# EAGLE design BPB_v16 (EAGLE 9.4.2)
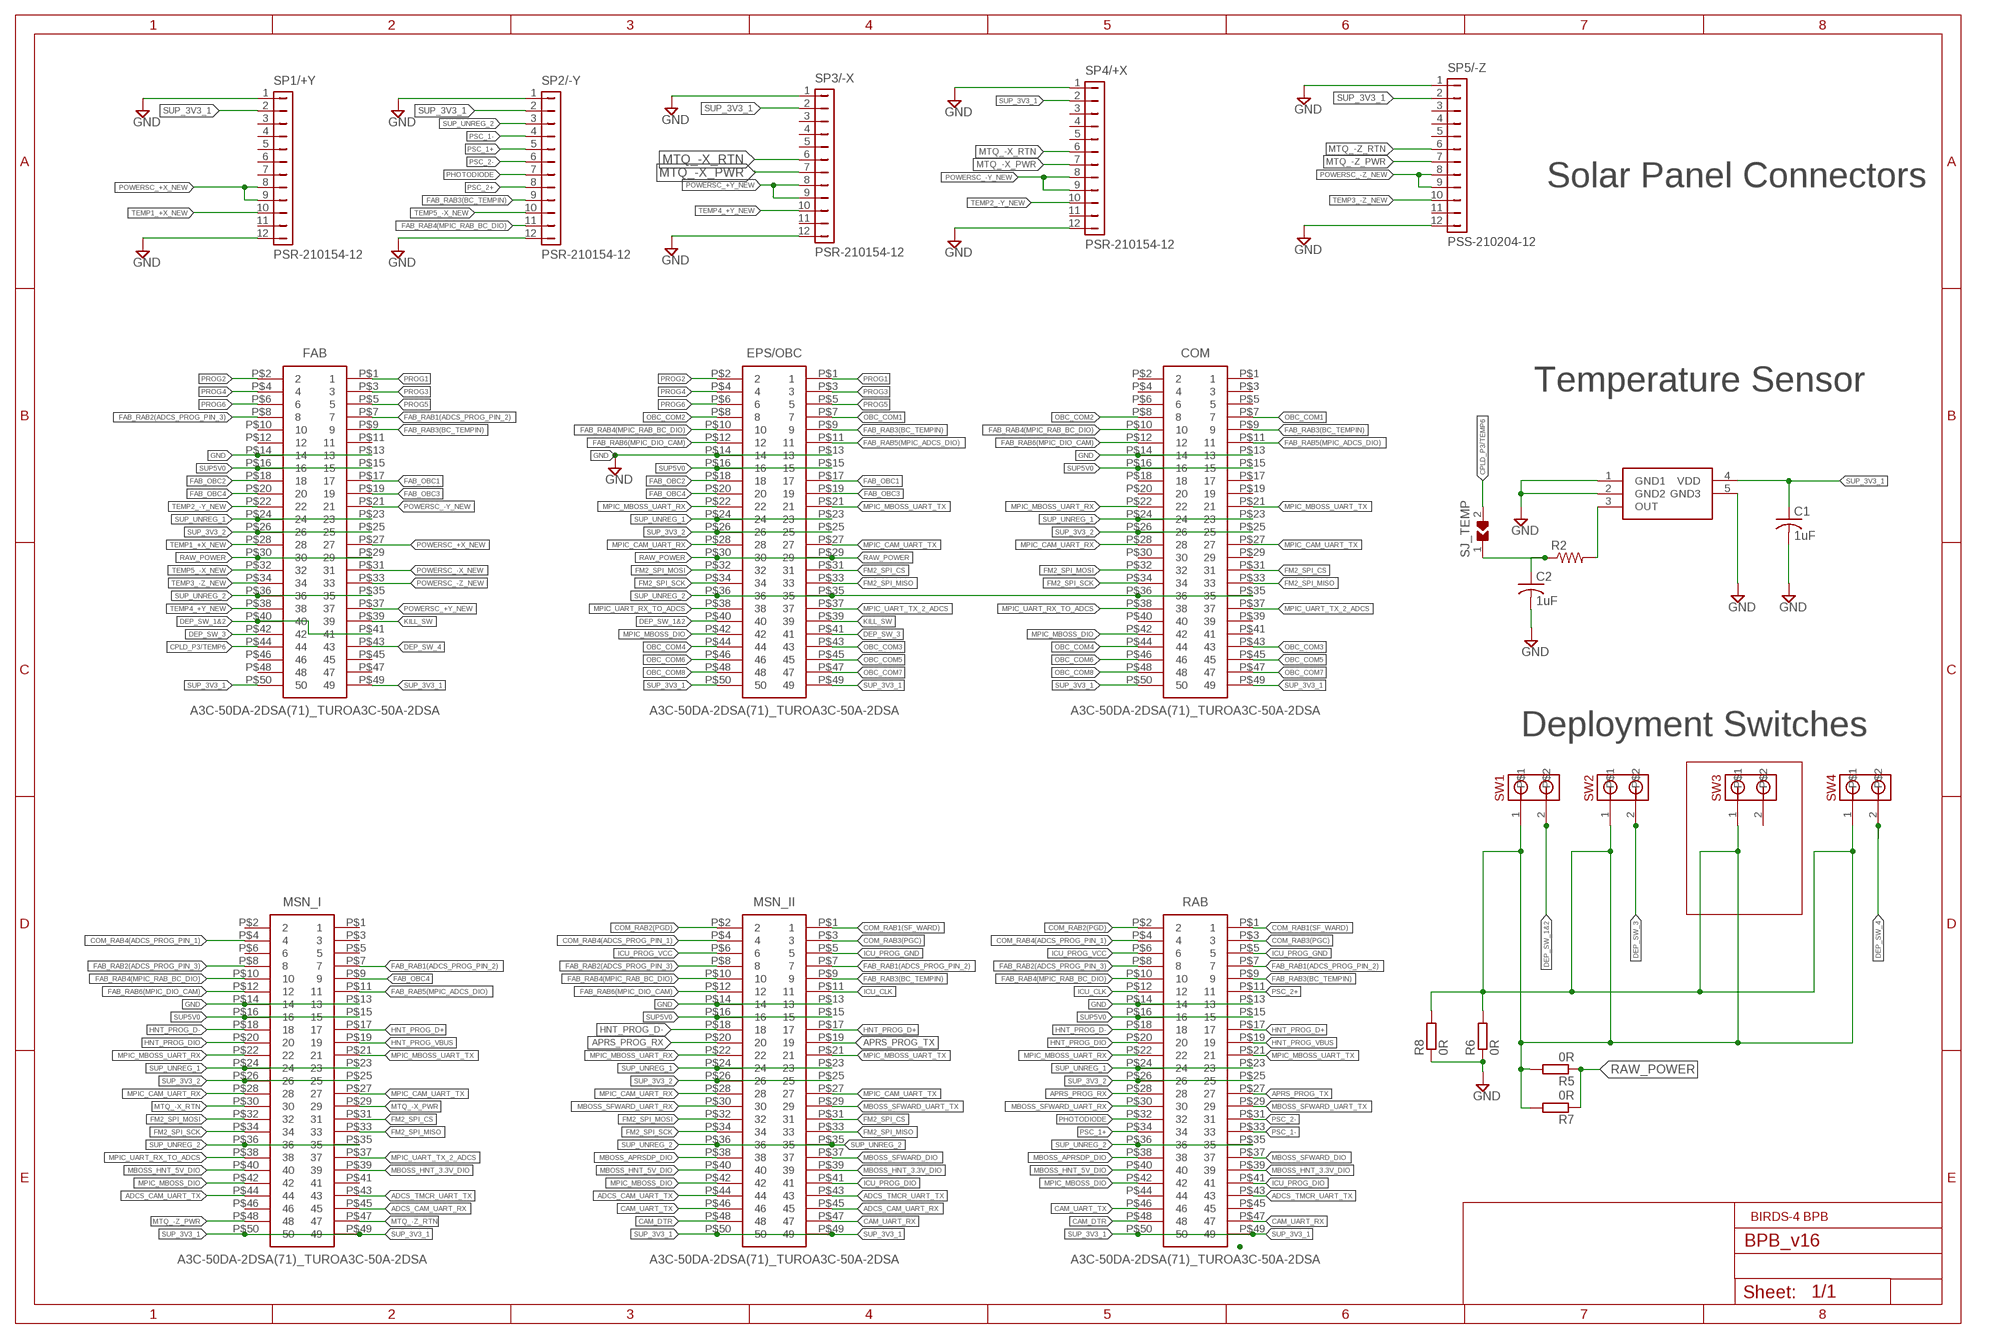
[diagram p0: schematic, sheet 1]

## Parts
C1  1uF  C-USC0603  [C0603]
C2  1uF  C-USC0603  [C0603]
COM  A3C-50DA-2DSA(71)_TUROA3C-50A-2DSA  [SHDR50W60P200_2X25_5000X400X44_TR]
EPS/OBC  A3C-50DA-2DSA(71)_TUROA3C-50A-2DSA  [SHDR50W60P200_2X25_5000X400X44_TR]
FAB  A3C-50DA-2DSA(71)_TUROA3C-50A-2DSA  [SHDR50W60P200_2X25_5000X400X44_TR]
MSN_I  A3C-50DA-2DSA(71)_TUROA3C-50A-2DSA  [SHDR50W60P200_2X25_5000X400X44_TR]
MSN_II  A3C-50DA-2DSA(71)_TUROA3C-50A-2DSA  [SHDR50W60P200_2X25_5000X400X44_TR]
R2  R-US_R0402  [R0402]
R5  0R  RR3216  [R3216]
R6  0R  RR3216  [R3216]
R7  0R  RR3216  [R3216]
R8  0R  RR3216  [R3216]
RAB  A3C-50DA-2DSA(71)_TUROA3C-50A-2DSA  [SHDR50W60P200_2X25_5000X400X44_TR]
SJ_TEMP  SJ_BY_TURO  [SJ_TURO]
SP1/+Y  PSR-210154-12  [PIN1X12/90]
SP2/-Y  PSR-210154-12  [PIN1X12/90]
SP3/-X  PSR-210154-12  [PIN1X12/90]
SP4/+X  PSR-210154-12  [PIN1X12/90]
SP5/-Z  PSS-210204-12  [PIN1X12]
SW1  MOLEX-CONN-2-0554600272  [MOLEX-CONN-2-BIRDS]
SW2  MOLEX-CONN-2-0554600272  [MOLEX-CONN-2-BIRDS]
SW3  MOLEX-CONN-2-0554600272  [MOLEX-CONN-2-BIRDS]
SW4  MOLEX-CONN-2-0554600272  [MOLEX-CONN-2-BIRDS]
U$3  LMT84DCKT  [SOT65P210X110-5N]

## Nets
ADCS_CAM_UART_RX: MSN_I.P$45 MSN_II.P$45
ADCS_CAM_UART_TX: MSN_I.P$44 MSN_II.P$44
ADCS_TMCR_UART_TX: MSN_I.P$43 MSN_II.P$43 RAB.P$43
APRS_PROG_RX: MSN_II.P$20 RAB.P$28
APRS_PROG_TX: MSN_II.P$19 RAB.P$27
CAM_DTR: MSN_II.P$48 RAB.P$48
CAM_UART_RX: MSN_II.P$47 RAB.P$47
CAM_UART_TX: MSN_II.P$46 RAB.P$46
COM_RAB1(SF_WARD): MSN_II.P$1 RAB.P$1
COM_RAB2(PGD): MSN_II.P$2 RAB.P$2
COM_RAB3(PGC): MSN_II.P$3 RAB.P$3
COM_RAB4(ADCS_PROG_PIN_1): MSN_I.P$4 MSN_II.P$4 RAB.P$4
CPLD_P3/TEMP6: FAB.P$44 SJ_TEMP.2
DEP_SW_1&2: EPS/OBC.P$40 FAB.P$40 FAB.P$41 SW1.2
DEP_SW_3: EPS/OBC.P$41 FAB.P$42 SW2.2
DEP_SW_4: FAB.P$43 SW4.2
DEP_SW_POWER: R5.2 R6.2 R7.2 R8.2 SW1.1 SW2.1 SW3.1 SW4.1
FAB_OBC1: EPS/OBC.P$17 FAB.P$17
FAB_OBC2: EPS/OBC.P$18 FAB.P$18
FAB_OBC3: EPS/OBC.P$19 FAB.P$19
FAB_OBC4: EPS/OBC.P$20 FAB.P$20 MSN_I.P$9
FAB_RAB1(ADCS_PROG_PIN_2): FAB.P$7 MSN_I.P$7 MSN_II.P$7 RAB.P$7
FAB_RAB2(ADCS_PROG_PIN_3): FAB.P$8 MSN_I.P$8 MSN_II.P$8 RAB.P$8
FAB_RAB3(BC_TEMPIN): COM.P$9 EPS/OBC.P$9 FAB.P$9 MSN_II.P$9 RAB.P$9 SP2/-Y.9
FAB_RAB4(MPIC_RAB_BC_DIO): COM.P$10 EPS/OBC.P$10 MSN_I.P$10 MSN_II.P$10 RAB.P$10 SP2/-Y.11
FAB_RAB5(MPIC_ADCS_DIO): COM.P$11 EPS/OBC.P$11 MSN_I.P$11
FAB_RAB6(MPIC_DIO_CAM): COM.P$12 EPS/OBC.P$12 MSN_I.P$12 MSN_II.P$12
FM2_SPI_CS: COM.P$31 EPS/OBC.P$31 MSN_I.P$31 MSN_II.P$31
FM2_SPI_MISO: COM.P$33 EPS/OBC.P$33 MSN_I.P$33 MSN_II.P$33
FM2_SPI_MOSI: COM.P$32 EPS/OBC.P$32 MSN_I.P$32 MSN_II.P$32
FM2_SPI_SCK: COM.P$34 EPS/OBC.P$34 MSN_I.P$34 MSN_II.P$34
GND [GND]: C1.2 C2.2 COM.P$13 COM.P$14 EPS/OBC.P$13 EPS/OBC.P$14 FAB.P$13 FAB.P$14 MSN_I.P$13 MSN_I.P$14 MSN_II.P$13 MSN_II.P$14 R6.1 R8.1 RAB.P$13 RAB.P$14 SP1/+Y.1 SP1/+Y.12 SP2/-Y.1 SP2/-Y.12 SP3/-X.1 SP3/-X.12 SP4/+X.1 SP4/+X.12 SP5/-Z.1 SP5/-Z.12 U$3.1(GND1) U$3.2(GND2) U$3.5(GND3)
HNT_PROG_D+: MSN_I.P$17 MSN_II.P$17 RAB.P$17
HNT_PROG_D-: MSN_I.P$18 MSN_II.P$18 RAB.P$18
HNT_PROG_DIO: MSN_I.P$20 RAB.P$20
HNT_PROG_VBUS: MSN_I.P$19 RAB.P$19
ICU_CLK: MSN_II.P$11 RAB.P$12
ICU_PROG_DIO: MSN_II.P$41 RAB.P$41
ICU_PROG_GND: MSN_II.P$5 RAB.P$5
ICU_PROG_VCC: MSN_II.P$6 RAB.P$6
KILL_SW: EPS/OBC.P$39 FAB.P$39
MBOSS_APRSDP_DIO: MSN_II.P$38 RAB.P$38
MBOSS_HNT_3.3V_DIO: MSN_I.P$39 MSN_II.P$39 RAB.P$39
MBOSS_HNT_5V_DIO: MSN_I.P$40 MSN_II.P$40 RAB.P$40
MBOSS_SFWARD_DIO: MSN_II.P$37 RAB.P$37
MBOSS_SFWARD_UART_RX: MSN_II.P$30 RAB.P$30
MBOSS_SFWARD_UART_TX: MSN_II.P$29 RAB.P$29
MPIC_CAM_UART_RX: COM.P$28 EPS/OBC.P$28 MSN_I.P$28 MSN_II.P$28
MPIC_CAM_UART_TX: COM.P$27 EPS/OBC.P$27 MSN_I.P$27 MSN_II.P$27
MPIC_MBOSS_DIO: COM.P$42 EPS/OBC.P$42 MSN_I.P$42 MSN_II.P$42 RAB.P$42
MPIC_MBOSS_UART_RX: COM.P$22 EPS/OBC.P$22 MSN_I.P$22 MSN_II.P$22 RAB.P$22
MPIC_MBOSS_UART_TX: COM.P$21 EPS/OBC.P$21 MSN_I.P$21 MSN_II.P$21 RAB.P$21
MPIC_UART_RX_TO_ADCS: COM.P$38 EPS/OBC.P$38 MSN_I.P$38
MPIC_UART_TX_2_ADCS: COM.P$37 EPS/OBC.P$37 MSN_I.P$37
MTQ_-X_PWR: MSN_I.P$29 SP3/-X.7 SP4/+X.7
MTQ_-X_RTN: MSN_I.P$30 SP3/-X.6 SP4/+X.6
MTQ_-Z_PWR: MSN_I.P$48 SP5/-Z.7
MTQ_-Z_RTN: MSN_I.P$47 SP5/-Z.6
N$2: C2.1 R2.1 SJ_TEMP.1
N$4: R2.2 U$3.3(OUT)
OBC_COM1: COM.P$7 EPS/OBC.P$7
OBC_COM2: COM.P$8 EPS/OBC.P$8
OBC_COM3: COM.P$43 EPS/OBC.P$43
OBC_COM4: COM.P$44 EPS/OBC.P$44
OBC_COM5: COM.P$45 EPS/OBC.P$45
OBC_COM6: COM.P$46 EPS/OBC.P$46
OBC_COM7: COM.P$47 EPS/OBC.P$47
OBC_COM8: COM.P$48 EPS/OBC.P$48
PHOTODIODE: RAB.P$32 SP2/-Y.7
POWERSC_+X_NEW [POWER]: FAB.P$27 SP1/+Y.8 SP1/+Y.9
POWERSC_+Y_NEW [POWER]: FAB.P$37 SP3/-X.8 SP3/-X.9
POWERSC_-X_NEW [POWER]: FAB.P$31
POWERSC_-Y_NEW [POWER]: FAB.P$21 SP4/+X.8 SP4/+X.9
POWERSC_-Z_NEW [POWER]: FAB.P$33 SP5/-Z.8 SP5/-Z.9
PROG1: EPS/OBC.P$1 FAB.P$1
PROG2: EPS/OBC.P$2 FAB.P$2
PROG3: EPS/OBC.P$3 FAB.P$3
PROG4: EPS/OBC.P$4 FAB.P$4
PROG5: EPS/OBC.P$5 FAB.P$5
PROG6: EPS/OBC.P$6 FAB.P$6
PSC_1+: RAB.P$34 SP2/-Y.5
PSC_1-: RAB.P$33 SP2/-Y.4
PSC_2+: RAB.P$11 SP2/-Y.8
PSC_2-: RAB.P$31 SP2/-Y.6
RAW_POWER: EPS/OBC.P$29 EPS/OBC.P$30 FAB.P$29 FAB.P$30 R5.1 R7.1
SUP5V0 [POWER]: COM.P$15 COM.P$16 EPS/OBC.P$15 EPS/OBC.P$16 FAB.P$15 FAB.P$16 MSN_I.P$15 MSN_I.P$16 MSN_II.P$15 MSN_II.P$16 RAB.P$15 RAB.P$16
SUP_3V3_1 [POWER]: C1.1 COM.P$49 COM.P$50 EPS/OBC.P$49 EPS/OBC.P$50 FAB.P$49 FAB.P$50 MSN_I.P$49 MSN_I.P$50 MSN_II.P$49 MSN_II.P$50 RAB.P$49 RAB.P$50 SP1/+Y.2 SP2/-Y.2 SP3/-X.2 SP4/+X.2 SP5/-Z.2 U$3.4(VDD)
SUP_3V3_2 [POWER]: COM.P$25 COM.P$26 EPS/OBC.P$25 EPS/OBC.P$26 FAB.P$25 FAB.P$26 MSN_I.P$25 MSN_I.P$26 MSN_II.P$25 MSN_II.P$26 RAB.P$25 RAB.P$26
SUP_UNREG_1 [POWER]: COM.P$23 COM.P$24 EPS/OBC.P$23 EPS/OBC.P$24 FAB.P$23 FAB.P$24 MSN_I.P$23 MSN_I.P$24 MSN_II.P$23 MSN_II.P$24 RAB.P$23 RAB.P$24
SUP_UNREG_2 [POWER]: COM.P$35 COM.P$36 EPS/OBC.P$35 EPS/OBC.P$36 FAB.P$35 FAB.P$36 MSN_I.P$35 MSN_I.P$36 MSN_II.P$35 MSN_II.P$36 RAB.P$35 RAB.P$36 SP2/-Y.3
TEMP1_+X_NEW: FAB.P$28 SP1/+Y.10
TEMP2_-Y_NEW: FAB.P$22 SP4/+X.10
TEMP3_-Z_NEW: FAB.P$34 SP5/-Z.10
TEMP4_+Y_NEW: FAB.P$38 SP3/-X.10
TEMP5_-X_NEW: FAB.P$32 SP2/-Y.10
Unconnected: COM.P$1 COM.P$2 COM.P$3 COM.P$4 COM.P$5 COM.P$6 COM.P$17 COM.P$18 COM.P$19 COM.P$20 COM.P$29 COM.P$30 COM.P$39 COM.P$40 COM.P$41 FAB.P$10 FAB.P$11 FAB.P$12 FAB.P$45 FAB.P$46 FAB.P$47 FAB.P$48 MSN_I.P$1 MSN_I.P$2 MSN_I.P$3 MSN_I.P$5 MSN_I.P$6 MSN_I.P$41 MSN_I.P$46 RAB.P$44 RAB.P$45 SP1/+Y.3 SP1/+Y.4 SP1/+Y.5 SP1/+Y.6 SP1/+Y.7 SP1/+Y.11 SP3/-X.3 SP3/-X.4 SP3/-X.5 SP3/-X.11 SP4/+X.3 SP4/+X.4 SP4/+X.5 SP4/+X.11 SP5/-Z.3 SP5/-Z.4 SP5/-Z.5 SP5/-Z.11 SW3.2

## Notes on the sheet
- Solar Panel Connectors
- Temperature Sensor
- Deployment Switches
- BIRDS-4 BPB

## Library data of the parts
C1 C2 = rcl:C-US: CAPACITOR, American symbol; SPICEPREFIX: C
COM EPS/OBC FAB MSN_I MSN_II RAB = Turo_collection:A3C-50DA-2DSA(71)_TURO: Hirose A3C Series 2mm 50 Way 2 Row Straight PCB Socket Through Hole Board to Wire <http://uk.rs-online.com/largeimages/R7793068-01.jpg> Source: Datasheet <https://www.google.co.uk/url?sa=t&rct=j&q=&esrc=s&source=web&cd=5&ved=0ahUKEwiW7Ov7l8PWAhUDCsAKHbxmCjsQFgg9MAQ&url=https://www.hirose.com/product/en/download_file/key_name/A3/category/Catalog/doc_file_id/49521/?file_category_id>
R2 = adafruit:R-US_: RESISTOR, American symbol
R5-R8 = Turo_collection:R: RESISTOR, European symbol; SPICEMODEL: NONE; SPICEPREFIX: R
SJ_TEMP = Turo_collection:SJ_BY_TURO
SP1/+Y SP2/-Y SP3/-X SP4/+X = Turo_collection:PSR-210154-12
SP5/-Z = Turo_collection:PSS-210204-12: Used for -Z panel on the backplane Created by Turo - 2018
SW1-SW4 = Turo_collection:MOLEX-CONN-2-0554600272
U$3 = LMT84DCKT:LMT84DCKT: 1.5V-Capable, 10 uA Analog Output Temperature Sensor in SC70 and TO-92 Source: Datasheet <http://uk.rs-online.com/web/p/products/8115860>; DESCRIPTION: 1.5V-Capable, 10 uA Analog Output Temperature Sensor in SC70 and TO-92; HEIGHT: 1.1mm; MANUFACTURER_NAME: Texas Instruments; MANUFACTURER_PART_NUMBER: LMT84DCKT; RS_PART_NUMBER: 8115860

## Net classes
1 GND: width 0.2 mm, clearance 0.127 mm
2 POWER: width 0.2 mm, clearance 0.02 mm

## Board
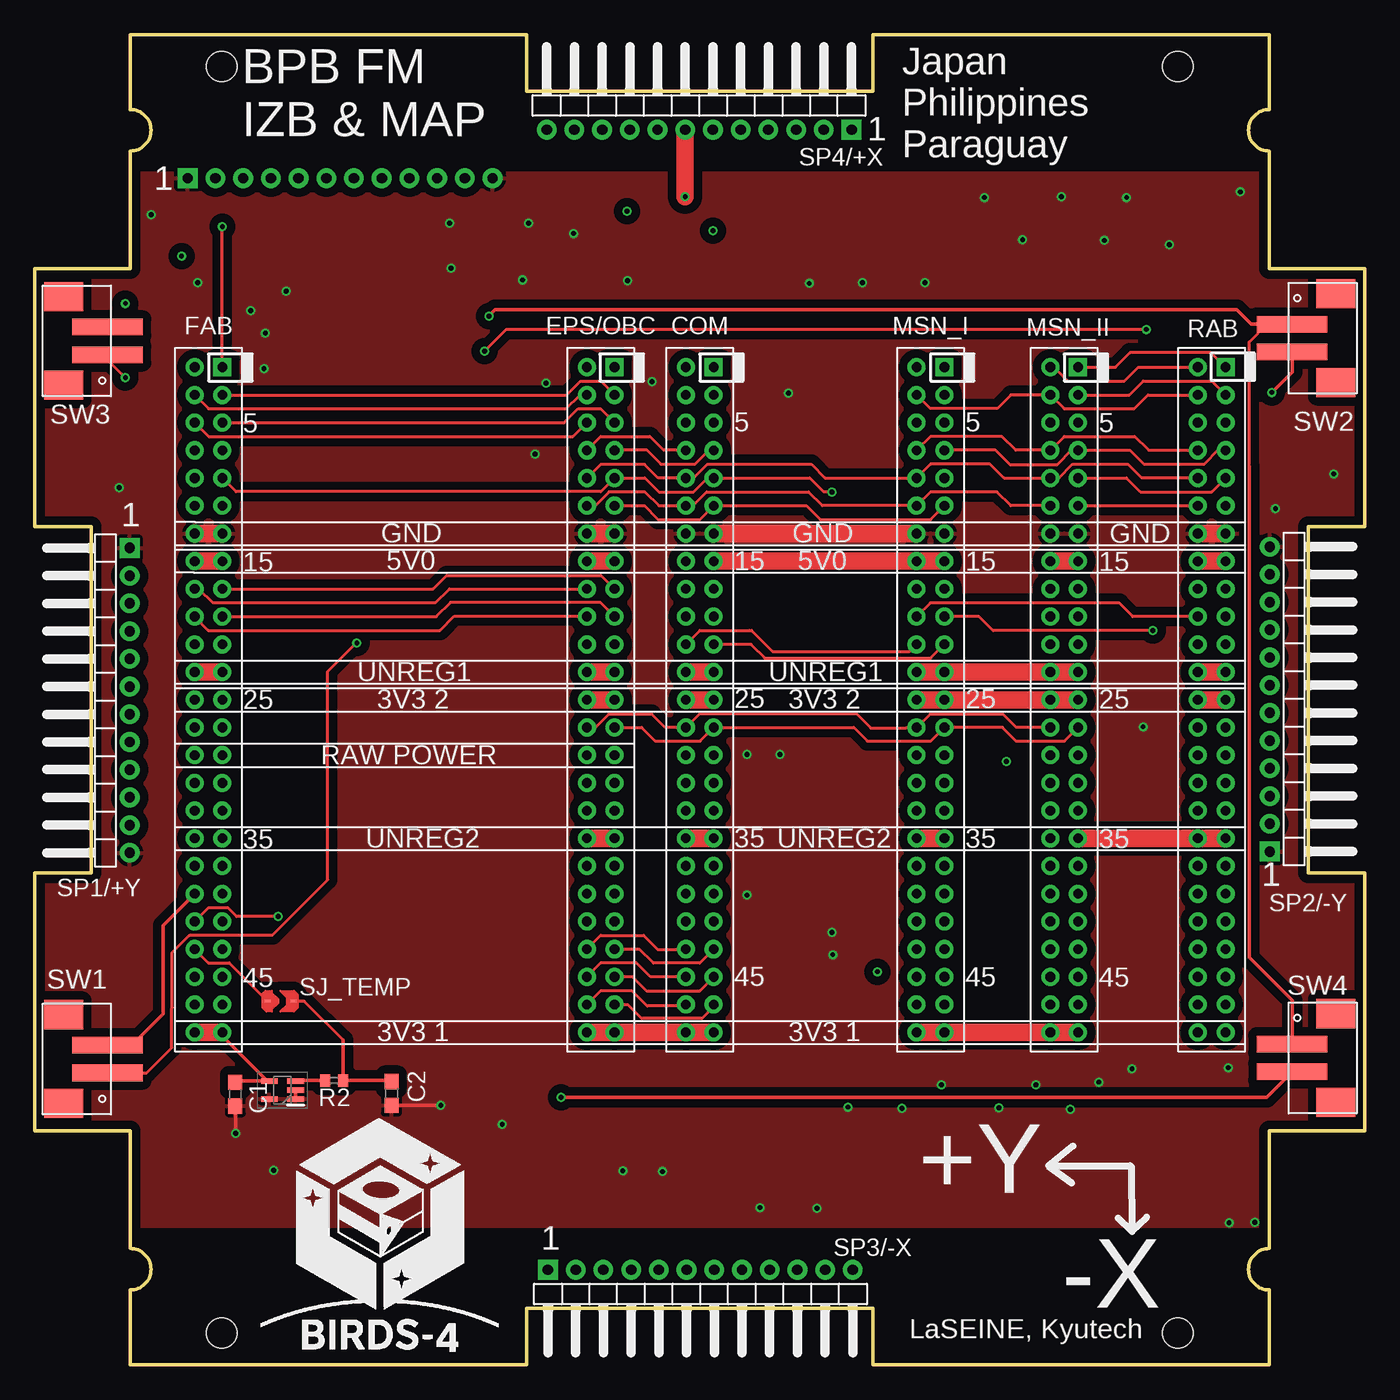
[diagram p1: board, top side]
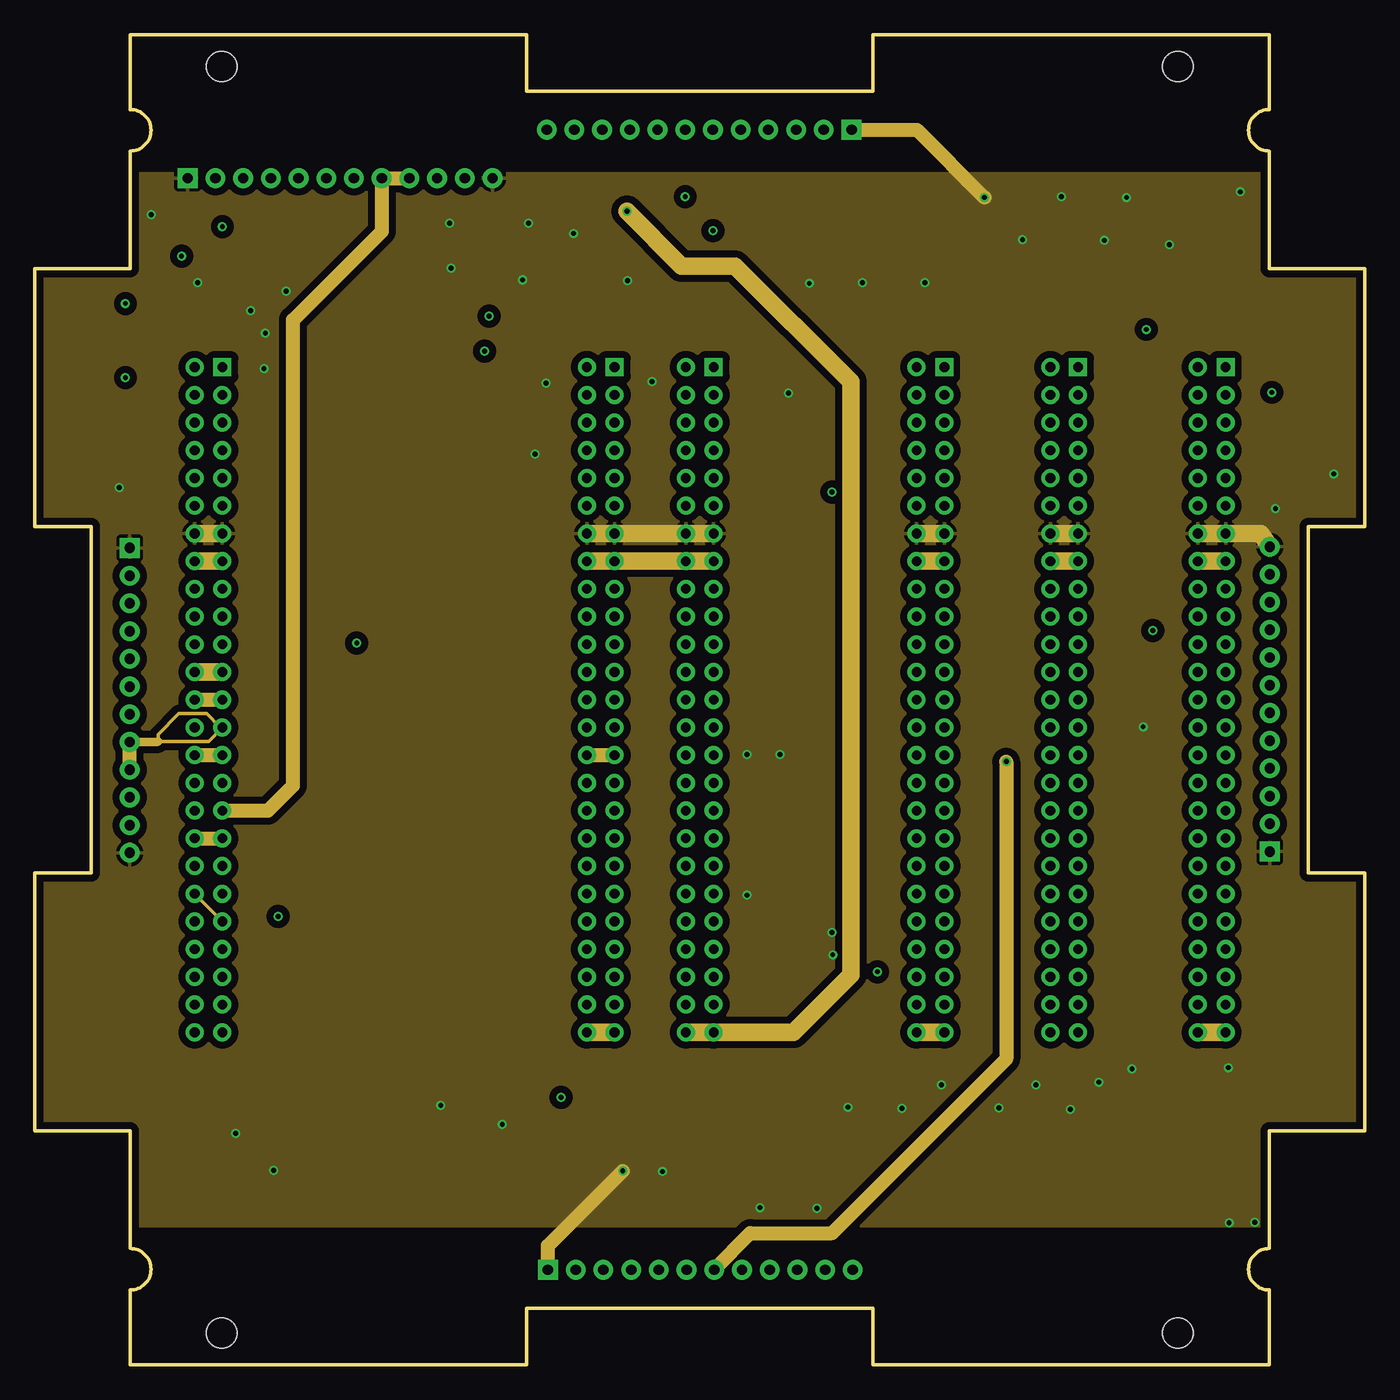
[diagram p2: board, inner layer L2_GND]
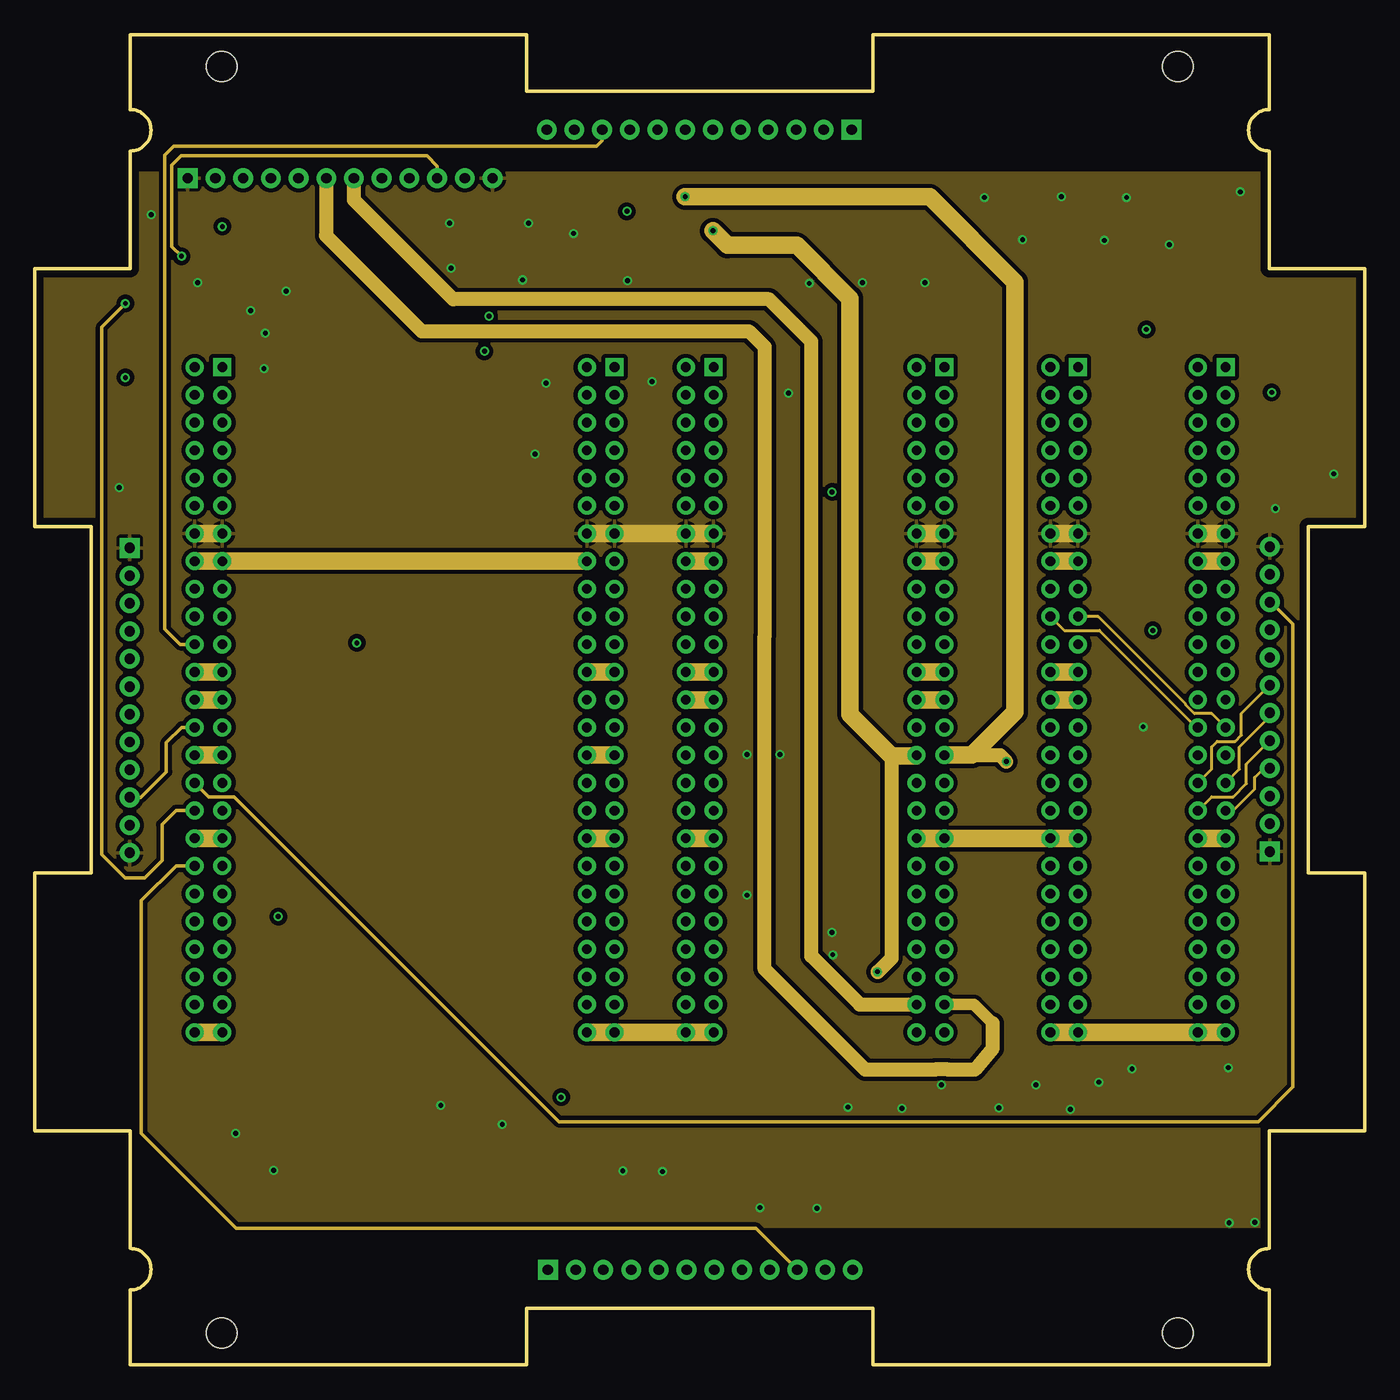
[diagram p3: board, inner layer L3]
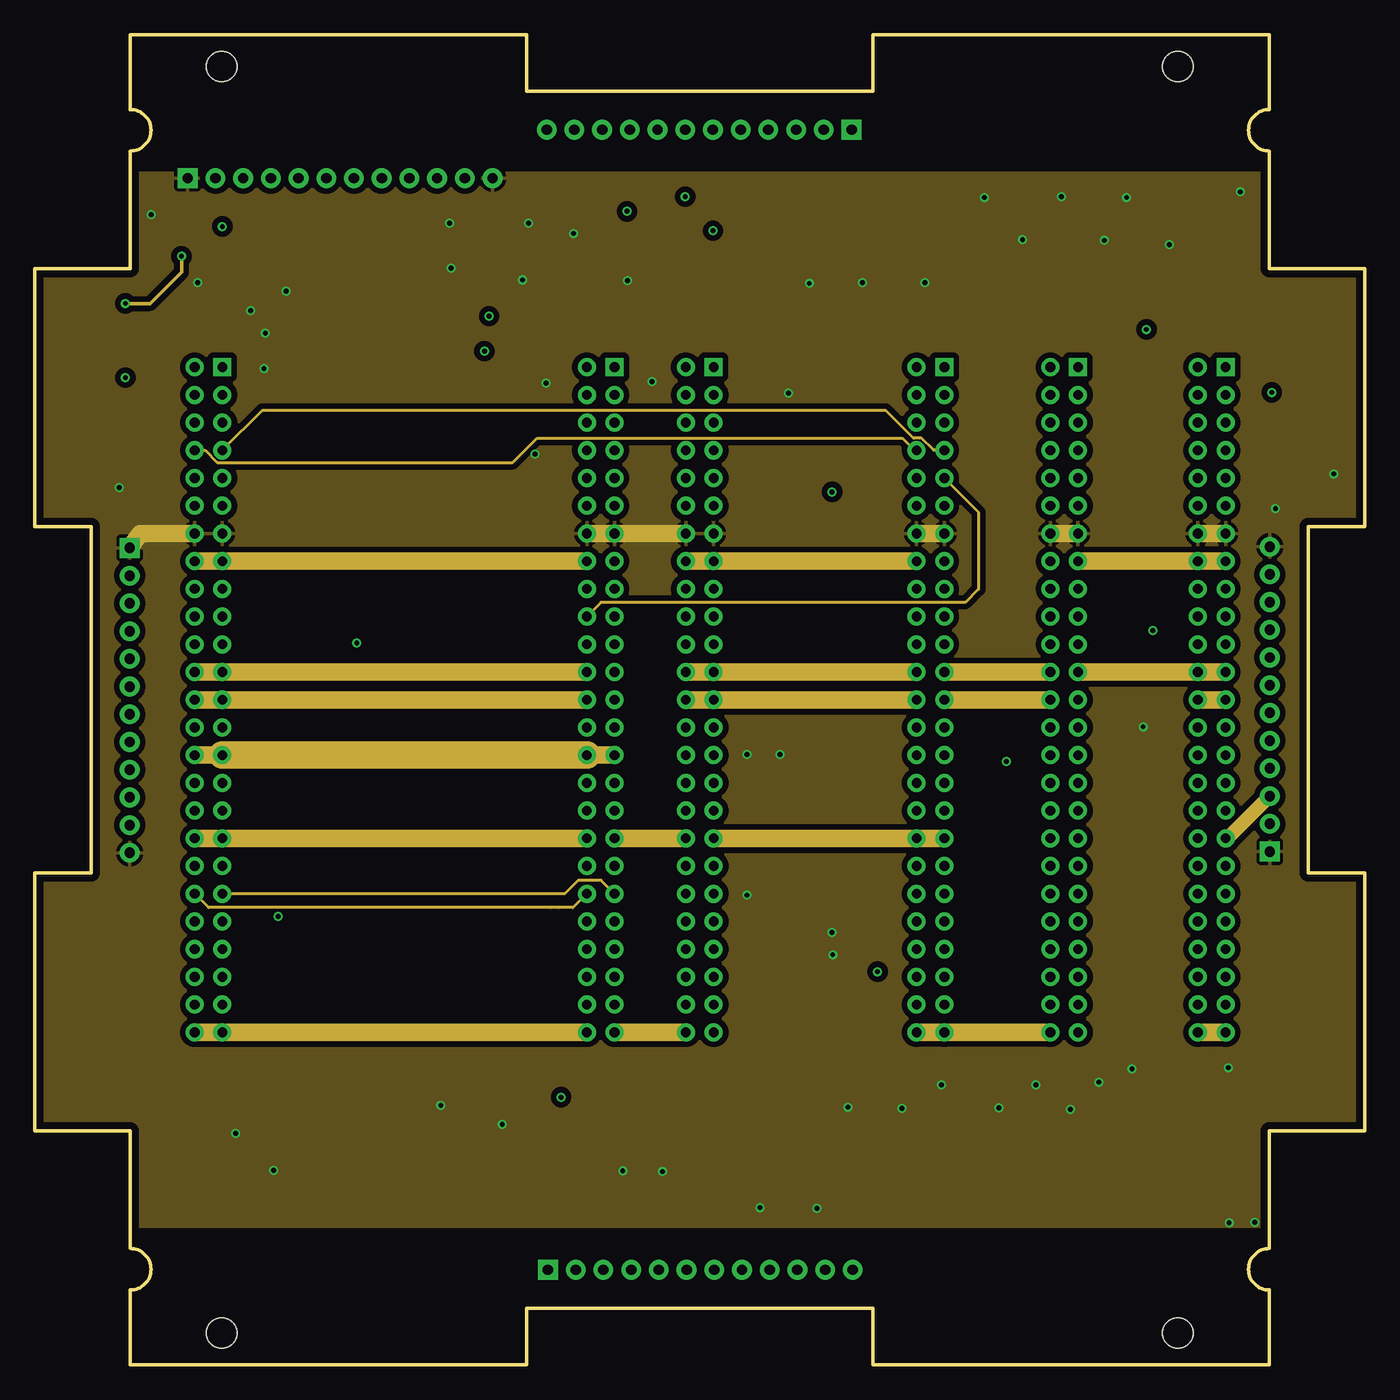
[diagram p4: board, inner layer L4_PWR]
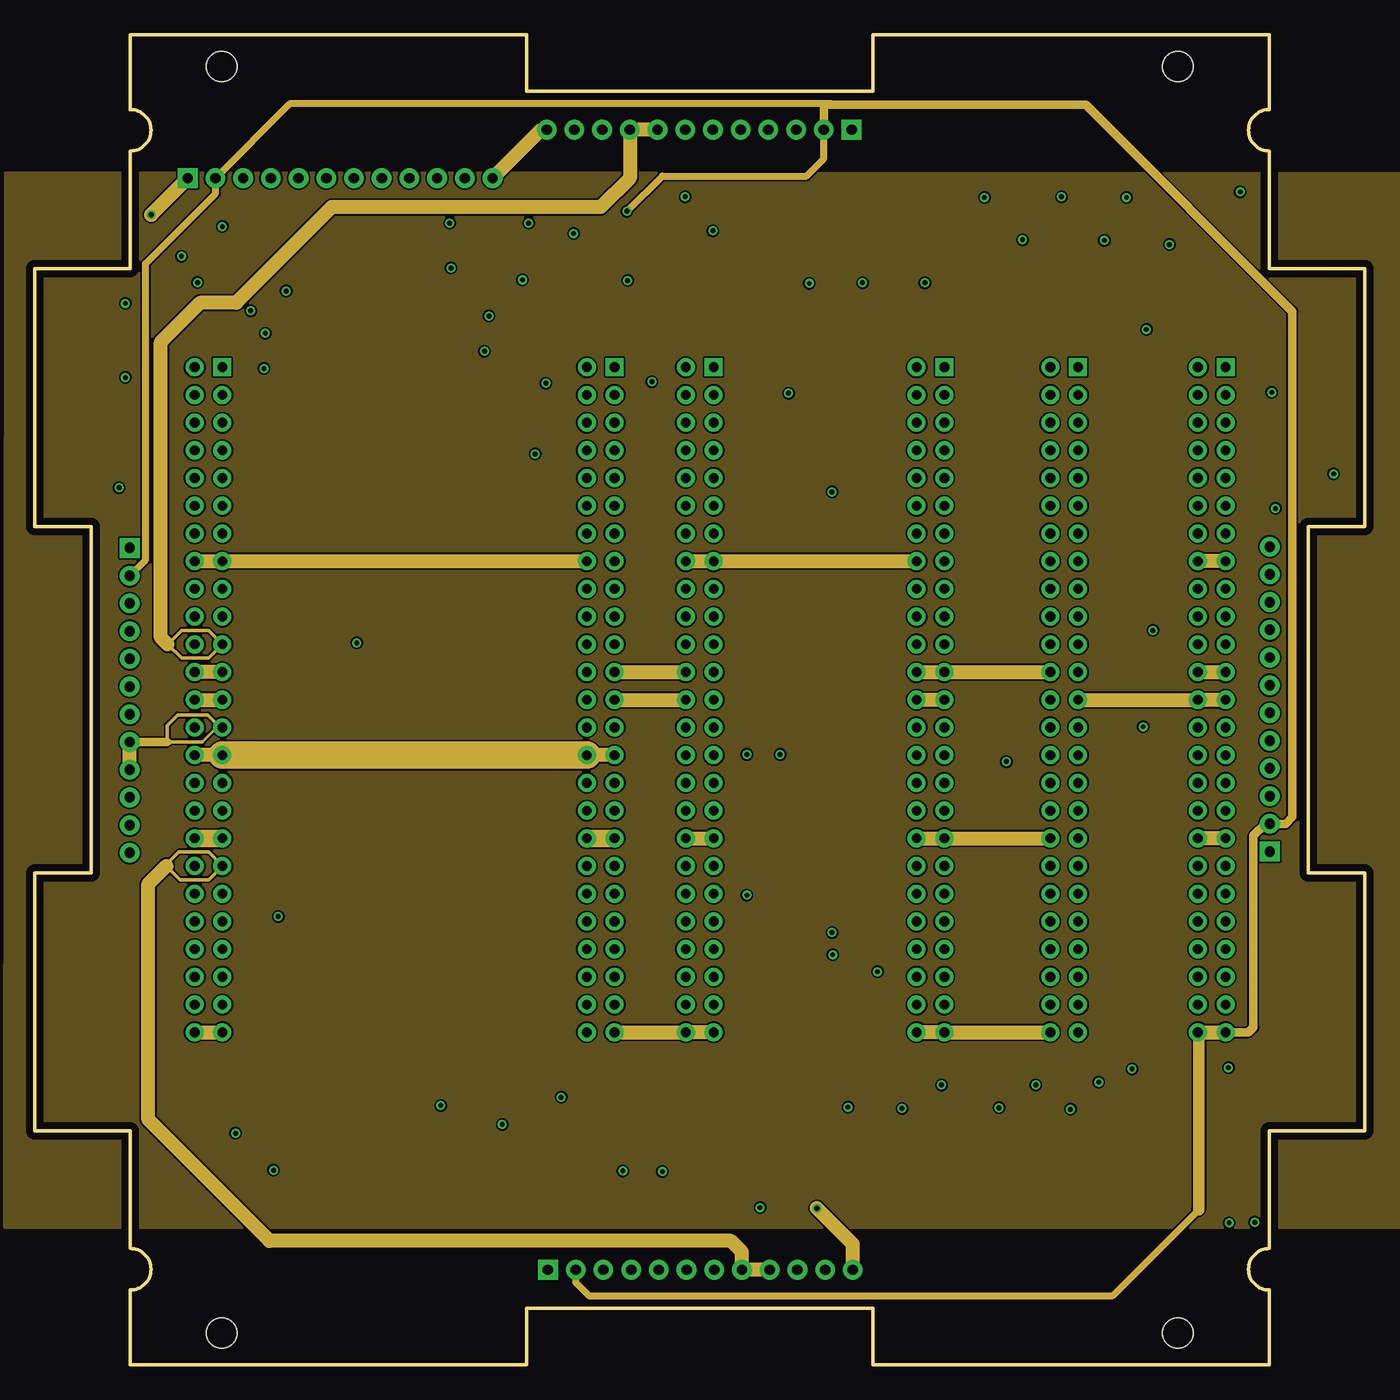
[diagram p5: board, inner layer L5_GND]
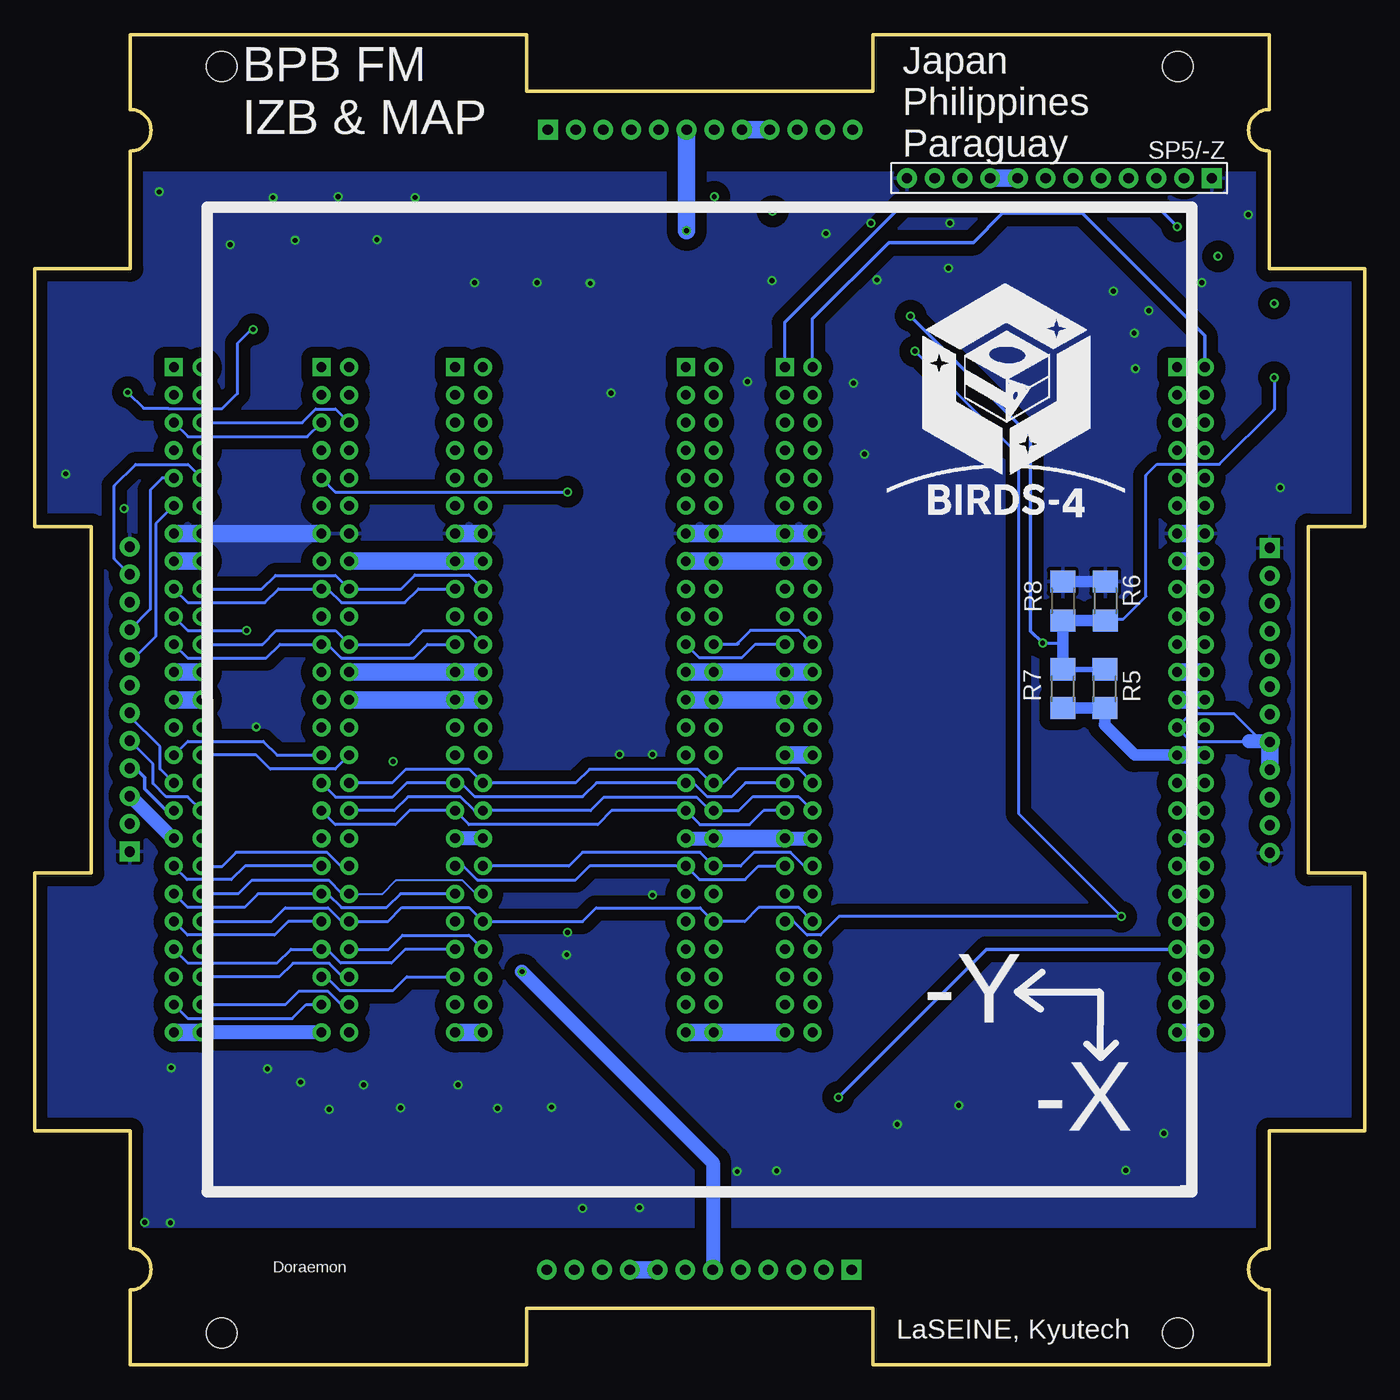
[diagram p6: board, bottom side, seen from below]

Size 96 x 96 mm. Coordinates in mm from the lower left corner, seen from the top.
Outline: 89.1,90.6 89.1,96 60.5,96 60.5,91.9 35.5,91.9 35.5,96 6.9,96 6.9,90.6 arc-180 6.9,87.6 6.9,79.1 0,79.1 0,60.5 4.1,60.5 4.1,35.5 0,35.5 0,16.9 6.9,16.9 6.9,8.4 arc-180 6.9,5.4 6.9,0 35.5,0 35.5,4.1 60.5,4.1 60.5,0 89.1,0 89.1,5.4
Outline: 89.1,90.6 arc180 89.1,87.6
Outline: 89.1,5.4 arc-180 89.1,8.4
Outline: 89.1,8.4 89.1,16.9 96,16.9 96,35.5 91.9,35.5 91.9,60.5 96,60.5 96,79.1 89.1,79.1 89.1,87.6
Outline: 89.1,5.4 arc-180 89.1,8.4
Outline: 89.1,87.6 arc-180 89.1,90.6
Copper layers (1+2*15+16): TOP 0.018mm / dielectric 0.25mm / L2_GND 0.035mm / dielectric 1mm / L5_GND 0.035mm / dielectric 0.25mm / BOTTOM 0.018mm
Design rules "pban_5mil-l4": minimum track width 5mil, minimum drill 0.3mm, track to track 5mil, track to pad 0.229mm, pad to pad 5mil, via to via 5mil, smd to smd 5mil, copper to edge 0.5mm, drill to drill 0.5mm, minimum pad ring 0.15mm, minimum via ring 0.15mm, stop-mask expansion 4mil, vias tented up to drill 0.35mm, thermal gap 10mil
Holes 2.2 mm at 13.5,2.3 82.5,2.3 82.5,93.7 13.5,93.7

### Footprints (pad centres in the part's own frame; a part is rotated, then mirrored left to right if it is on the bottom)
C0603 = smd 1.1 x 1: 1 -0.85,0; 2 0.85,0
SHDR50W60P200_2X25_5000X400X44_TR = drill 0.7 pad 1.3 square: P$1 0,2 | drill 0.7 pad 1.3: P$2 0,0; P$3 2,2; P$4 2,0; P$5 4,2; P$6 4,0; P$7 6,2; P$8 6,0; P$9 8,2; P$10 8,0; P$11 10,2; P$12 10,0; P$13 12,2; P$14 12,0; P$15 14,2; P$16 14,0; P$17 16,2; P$18 16,0; P$19 18,2; P$20 18,0; P$21 20,2; P$22 20,0; P$23 22,2; P$24 22,0; P$25 24,2; P$26 24,0; P$27 26,2; P$28 26,0; P$29 28,2; P$30 28,0; P$31 30,2; P$32 30,0; P$33 32,2; P$34 32,0; P$35 34,2; P$36 34,0; P$37 36,2; P$38 36,0; P$39 38,2; P$40 38,0; P$41 40,2; P$42 40,0; P$43 42,2; P$44 42,0; P$45 44,2; P$46 44,0; P$47 46,2; P$48 46,0; P$49 48,2; P$50 48,0
R0402 = smd 0.7 x 0.9: 1 -0.65,0; 2 0.65,0
R3216 = smd 1.6 x 1.8: 1 -1.4,0; 2 1.4,0
SJ_TURO = smd 0.406 x 0.203: 1 -0.7,0; 2 1.15,0
PIN1X12/90 = drill 0.75 pad 1.422 square: 1 -0.048,-0.063 | drill 0.75 pad 1.422: 2 -2.048,-0.063; 3 -4.048,-0.063; 4 -6.048,-0.063; 5 -8.048,-0.063; 6 -10.048,-0.063; 7 -12.048,-0.063; 8 -14.048,-0.063; 9 -16.048,-0.063; 10 -18.048,-0.063; 11 -20.048,-0.063; 12 -22.048,-0.063
PIN1X12 = drill 0.75 pad 1.422 square: 1 -0.048,-0.063 | drill 0.75 pad 1.422: 2 -2.048,-0.063; 3 -4.048,-0.063; 4 -6.048,-0.063; 5 -8.048,-0.063; 6 -10.048,-0.063; 7 -12.048,-0.063; 8 -14.048,-0.063; 9 -16.048,-0.063; 10 -18.048,-0.063; 11 -20.048,-0.063; 12 -22.048,-0.063
MOLEX-CONN-2-BIRDS = smd 1.2 x 5.1: 1 2.6,2.55; 2 0.6,2.55 | smd 2.1 x 2.8: P$3 -1.6,-0.6; P$4 4.8,-0.6
SOT65P210X110-5N = smd 1.2 x 0.4: 1 -0.95,0.65; 2 -0.95,0; 3 -0.95,-0.65; 4 0.95,-0.65; 5 0.95,0.65

### Placement (x,y rotation side)
C1  14.48,19.53 270 top
C2  25.76,19.58 270 top
COM  47,72 270 top
EPS/OBC  39.85,72 270 top
FAB  11.55,72 270 top
MSN_I  63.65,72 270 top
MSN_II  73.3,72 270 top
R2  21.62,20.52 180 top
R5  18.77,48.8 90 bottom
R6  18.74,55.12 270 bottom
R7  21.8,48.8 90 bottom
R8  21.8,55.12 270 bottom
RAB  83.95,72 270 top
SJ_TEMP  17.97,26.25 180 top
SP1/+Y  6.8,59 90 top
SP2/-Y  89.2,37 270 top
SP3/-X  37,6.8 180 top
SP4/+X  59,89.2 0 top
SP5/-Z  11,85.7 0 bottom
SW1  2.7,23.68 270 top
SW2  93.3,72.5 90 top
SW3  2.7,75.5 270 top
SW4  93.3,20.55 90 top
U$3  17.88,19.84 180 top

### Tracks (layer width: path | path; a pad name or v marks a point on that pad's centre or on a via)
ADCS_CAM_UART_RX
  BOTTOM 0.203: MSN_I.P$45 69.15,28 70.15,27 73.95,27 74.95,28 MSN_II.P$45
ADCS_CAM_UART_TX
  BOTTOM 0.203: MSN_II.P$44 70.45,30 69.45,31 64.65,31 MSN_I.P$44
ADCS_TMCR_UART_TX
  BOTTOM 0.203: MSN_I.P$43 69.25,30 70.25,29 73.9,29 74.9,30 MSN_II.P$43 77.5,30 78.5,29 84.95,29 RAB.P$43
APRS_PROG_RX
  L3 0.203: MSN_II.P$20 74.3,53 76.85,53 83.85,46 RAB.P$28
APRS_PROG_TX
  L3 0.203: RAB.P$27 84.95,47 83.7,47 83.07,47.63 83.07,47.68 76.75,54 MSN_II.P$19
CAM_DTR
  BOTTOM 0.203: RAB.P$48 77.9,26 76.92,26.98 74.85,26.98 73.87,26 MSN_II.P$48
CAM_UART_RX
  BOTTOM 0.203: RAB.P$47 84.95,25 77.4,25 76.4,26 MSN_II.P$47
CAM_UART_TX
  BOTTOM 0.203: MSN_II.P$46 73.76,28 74.74,28.98 77.36,28.98 78.34,28 RAB.P$46
COM_RAB1(SF_WARD)
  TOP 0.203: MSN_II.P$1 78,72 79.05,73.05 84.9,73.05 RAB.P$1
COM_RAB2(PGD)
  TOP 0.2: 79.65,72 RAB.P$2
  TOP 0.203: 79.65,72 78.65,71 74.55,71 74.53,71.02 74.51,71.02 74.32,71.21 74.32,71.23 73.55,72 MSN_II.P$2
COM_RAB3(PGC)
  TOP 0.2: 84.95,71 RAB.P$3
  TOP 0.203: MSN_II.P$3 79,70 80,71 84.95,71
COM_RAB4(ADCS_PROG_PIN_1)
  TOP 0.203: RAB.P$4 80.35,70 79.35,69 74.3,69 MSN_II.P$4 70.45,70 69.47,69.02 64.63,69.02 MSN_I.P$4
CPLD_P3/TEMP6
  TOP 0.203: FAB.P$44 12.53,29.02 14.05,29.02 SJ_TEMP.2
DEP_SW_1&2
  TOP 0.203: 5.03,23.06 5.03,23.3 SW1.2
  TOP 0.254: FAB.P$40 9.27,31.72 9.27,25.32 7.01,23.06 5.03,23.06
  L2_GND 0.254: FAB.P$40 FAB.P$41
  L4_PWR 0.203: FAB.P$40 12.55,33 37.2,33 37.21,33.01 37.79,33.01 37.8,33 38.85,33 EPS/OBC.P$40
DEP_SW_3  (via drill 0.35)
  TOP 0.2: v17.58,32.36 14.57,32.36 13.96,32.98 12.53,32.98 FAB.P$42
  TOP 0.203: v80.24,74.73 34.04,74.73 v32.46,73.15
  TOP 0.254: SW2.2 90.75,71.65 v89.28,70.18
  BOTTOM 0.203: v89.28,70.18 88.14,69.04 86.37,69.04 86.36,69.02 82.45,69.02 81.39,70.08 81.36,70.08 81.36,73.74 80.37,74.73 v80.24,74.73 | v32.46,73.15 24.99,65.68 24.99,39.78 v17.58,32.36 37.95,32.36 39.29,31.02 40.26,31.02 41.24,32 EPS/OBC.P$41
DEP_SW_4  (via drill 0.35)
  TOP 0.254: v37.99,19.32 88.92,19.32 SW4.2
  BOTTOM 0.254: v37.99,19.32 33.87,23.43 29.8,27.51 27.31,30 FAB.P$43
DEP_SW_POWER  (via drill 0.35)
  TOP 0.203: v6.55,71.25 5.25,72.55 SW3.1 | v23.25,52.1 23.2,52.1 21.15,50.05 21.15,35.01 17.16,31.02 11.21,31.02 11.18,30.98 11.14,30.98 9.94,29.77 9.94,25.77 9.9,25.74 9.9,22.88 8.1,21.07 SW1.1 | 87.65,64.85 87.65,73.81 88.94,75.1 SW2.1
  TOP 0.254: SW2.1 87.8,75.1 86.75,76.15 33.25,76.15 v32.79,75.69 | 87.65,64.85 87.65,29.4 90.75,26.3 SW4.1
  BOTTOM 0.203: R6.2 18.66,53.8 17.45,53.8 15.8,55.45 15.8,64.2 15,65 10.5,65 6.55,68.95 v6.55,71.25 | v23.25,52.1 21.8,52.1
  BOTTOM 0.254: v23.25,52.1 24.12,52.98 24.12,67.03 v32.79,75.69
  BOTTOM 0.406: R5.2 R7.2
  BOTTOM 0.813: R6.2 R8.2 21.8,52.1 R7.2
FAB_OBC1
  TOP 0.203: FAB.P$17 28.75,56 29.73,56.98 40.87,56.98 EPS/OBC.P$17
FAB_OBC2
  TOP 0.203: FAB.P$18 11.85,56 12.83,55.02 28.95,55.02 29.93,56 EPS/OBC.P$18
FAB_OBC3
  TOP 0.203: FAB.P$19 28.98,54 30,55.02 40.83,55.02 EPS/OBC.P$19
FAB_OBC4
  TOP 0.203: FAB.P$20 12.54,53.01 29.26,53.01 30.28,54.03 39.82,54.03 EPS/OBC.P$20
  L4_PWR 0.203: MSN_I.P$9 68.12,61.53 68.12,55.98 67.16,55.02 40.87,55.02 EPS/OBC.P$20
FAB_RAB1(ADCS_PROG_PIN_2)
  TOP 0.203: MSN_I.P$7 69.35,66 70.37,64.98 73.81,64.98 74.83,66 MSN_II.P$7 79.05,66 80.05,65 84.4,65 85.4,66 RAB.P$7
  L4_PWR 0.203: MSN_I.P$7 64.89,66 64.02,66.88 63.42,66.88 61.42,68.88 16.43,68.88 FAB.P$7
FAB_RAB2(ADCS_PROG_PIN_3)
  TOP 0.203: RAB.P$8 80.4,66 79.4,67 74.3,67 MSN_II.P$8 70.8,66 69.8,67 64.65,67 MSN_I.P$8
  L4_PWR 0.203: FAB.P$8 12.3,66 13.19,65.12 34.51,65.12 36.27,66.88 62.62,66.88 63.5,66 MSN_I.P$8
FAB_RAB3(BC_TEMPIN)  (via drill 0.35)
  TOP 0.203: MSN_II.P$9 78.8,64 79.8,63 84.95,63 RAB.P$9 | v57.55,63 56.95,63 55.95,64 COM.P$9 48.55,64 47.55,63 45.05,63 44.05,64 EPS/OBC.P$9 40.87,63.02 14.53,63.02 FAB.P$9
  BOTTOM 0.203: MSN_II.P$9 74.3,63 v57.55,63 | RAB.P$9 86.8,64 87.65,63.15 87.65,54.53 SP2/-Y.9
FAB_RAB4(MPIC_RAB_BC_DIO)
  TOP 0.203: EPS/OBC.P$10 39.86,64 40.84,64.98 44.02,64.98 45,64 COM.P$10 47.55,64 48.55,65 56.05,65 57.05,64 MSN_I.P$10 64.65,65 68.95,65 69.95,64 MSN_II.P$10 73.9,64 74.9,65 78.9,65 79.9,64 RAB.P$10
  BOTTOM 0.203: SP2/-Y.11 90.25,58.16 90.25,63.45 88.72,64.98 84.93,64.98 RAB.P$10
FAB_RAB5(MPIC_ADCS_DIO)
  TOP 0.203: EPS/OBC.P$11 44,62 45,61 48,61 COM.P$11 55.7,62 56.7,61 64.65,61 MSN_I.P$11
FAB_RAB6(MPIC_DIO_CAM)
  TOP 0.203: EPS/OBC.P$12 40.35,62 40.4,61.95 41.45,63 44.05,63 45.05,62 COM.P$12 47.5,62 48.5,63 55.85,63 56.85,62 MSN_I.P$12 64.65,63 69.45,63 70.45,62 MSN_II.P$12
FM2_SPI_CS
  BOTTOM 0.203: MSN_II.P$31 74.28,40.98 70.17,40.98 69.15,42 MSN_I.P$31 65.22,42 64.24,41.02 56.44,41.02 55.46,42 COM.P$31 48.45,42 47.47,41.02 45.68,41.02 44.7,42 EPS/OBC.P$31
FM2_SPI_MISO
  BOTTOM 0.203: EPS/OBC.P$33 43.4,40 44.4,39 48,39 COM.P$33 54.35,40 55.35,39 64.65,39 MSN_I.P$33 68.95,40 69.95,39 74.3,39 MSN_II.P$33
FM2_SPI_MOSI
  BOTTOM 0.203: MSN_II.P$32 70.2,42 69.2,43 64.65,43 MSN_I.P$32 56.95,42 55.97,42.98 48.13,42.98 47.15,42 COM.P$32 46.3,42 45.3,43 40.85,43 EPS/OBC.P$32
FM2_SPI_SCK
  BOTTOM 0.203: MSN_II.P$34 70.05,40 69.05,41 65.26,41 64.26,40 MSN_I.P$34 55.88,40 54.9,40.98 48.23,40.98 47.25,40 COM.P$34 45.18,40 44.2,40.98 40.84,40.98 39.86,40 EPS/OBC.P$34
GND  (via drill 0.35)
  TOP 0.254: v29.31,18.72 29.3,18.73 C2.2 | v14.5,16.71 14.5,18.66 C1.2 | U$3.2 U$3.1
  TOP 1.27: FAB.P$14 FAB.P$13 | EPS/OBC.P$14 EPS/OBC.P$13 | COM.P$13 MSN_I.P$14 | RAB.P$13 RAB.P$14
  L2_GND 1.016: SP3/-X.1 37.05,8.6 v42.45,14 | SP4/+X.1 63.66,89.14 v68.55,84.25
  L2_GND 1.27: RAB.P$14 RAB.P$13 88.48,60 SP2/-Y.12 | MSN_II.P$13 MSN_II.P$14 | MSN_I.P$13 MSN_I.P$14 | COM.P$13 COM.P$14 EPS/OBC.P$13 EPS/OBC.P$14 | FAB.P$13 FAB.P$14
  L3 1.27: FAB.P$14 FAB.P$13 | EPS/OBC.P$14 EPS/OBC.P$13 COM.P$14 COM.P$13 | MSN_I.P$14 MSN_I.P$13 | MSN_II.P$14 MSN_II.P$13 | RAB.P$13 RAB.P$14
  L4_PWR 1.27: COM.P$14 EPS/OBC.P$13 EPS/OBC.P$14 | MSN_I.P$14 MSN_I.P$13 | MSN_II.P$13 MSN_II.P$14 | RAB.P$14 RAB.P$13 | FAB.P$14 7.61,60 SP1/+Y.1
  L5_GND 1.016: SP3/-X.12 59.05,8.7 v56.45,11.3 | SP4/+X.12 36.55,89.14 SP5/-Z.12 | SP5/-Z.1 v8.42,83.01 v8.41,83.01
  BOTTOM 0.813: R8.1 R6.1
  BOTTOM 1.27: FAB.P$13 FAB.P$14 | EPS/OBC.P$14 EPS/OBC.P$13 COM.P$14 COM.P$13 | MSN_I.P$13 MSN_I.P$14 | RAB.P$13 RAB.P$14 MSN_II.P$13
  other vias: 11.76,78.11 15.59,76.07 16.65,74.45 29.95,82.4 30.05,79.15 16.55,71.9 74.1,84.3 78.8,84.25 71.3,81.2 77.2,81.15 81.9,80.85 64.25,78.1 59.75,78.1 55.9,78.05 42.8,78.25 38.9,81.65 35.65,82.4 6.1,63.3 17.24,14.04 58.7,18.6 62.6,18.5 69.6,18.55 74.75,18.45 52.35,11.35 88.05,10.3 86.2,10.25 79.2,21.35 51.4,44.05 53.8,44.05 44.55,70.95 80,46.05 33.75,17.35 65.45,20.2 72.25,20.2 76.8,20.4 45.3,13.95 57.55,31.2 57.6,29.6 51.4,33.9 54.41,70.12 36.9,70.85 18.15,77.5 35.2,78.3 89.55,61.8 86.15,21.45 36.12,65.74 93.75,64.3 87,84.65
  pour L2_GND (isolate 0.5): -2.09,85.99 -2.1,86 98.2,86 98.25,86.05 98.25,15.51 92.22,10.06 92.22,10 -2.09,10
  pour TOP (isolate 0.61, rank 5): -2.08,86 97.06,86 96.99,85.9 96.99,9.83 96.98,10 -2.08,10 -2.07,10.16 -2.07,86
  pour L3 (isolate 0.305, rank 5): -2.09,86 97.15,86 97.15,10.02 97.16,10 -2.09,10
  pour L4_PWR (isolate 0.406, rank 5): -2.09,86 99.5,86 99.5,10.13 99.54,10 -2.04,10 -2.07,9.91 -2.07,85.97
  pour BOTTOM (isolate 0.813, rank 5): -1.17,86 99.53,86 99.46,85.73 99.46,9.94 99.13,10 -1.14,10 -1.17,9.93
HNT_PROG_D+
  BOTTOM 0.203: RAB.P$17 84.95,55 79.4,55 78.4,56 MSN_II.P$17 74.85,56 73.85,55 69.3,55 68.3,56 MSN_I.P$17
HNT_PROG_D-
  BOTTOM 0.203: RAB.P$18 79.6,56 78.62,56.98 74.28,56.98 MSN_II.P$18 69.55,56 68.55,57 64.65,57 MSN_I.P$18
HNT_PROG_DIO
  TOP 0.203: RAB.P$20 79.25,54 78.27,54.98 64.63,54.98 MSN_I.P$20
HNT_PROG_VBUS  (via drill 0.35)
  TOP 0.203: v80.7,53 80.68,52.98 69.17,52.98 68.15,54 MSN_I.P$19
  BOTTOM 0.203: RAB.P$19 84.95,53 v80.7,53
ICU_CLK
  TOP 0.203: MSN_II.P$11 RAB.P$12
ICU_PROG_DIO
  BOTTOM 0.203: MSN_II.P$41 77.7,32 78.68,31.02 84.97,31.02 RAB.P$41
ICU_PROG_GND
  BOTTOM 0.203: RAB.P$5 84.93,66.98 76.32,66.98 MSN_II.P$5
ICU_PROG_VCC
  BOTTOM 0.203: RAB.P$6 76.69,68 75.71,68.98 74.3,68.98 74.3,68.99 74.29,68.99 MSN_II.P$6
KILL_SW
  L4_PWR 0.203: EPS/OBC.P$39 40.88,34.97 39.22,34.97 38.25,34 FAB.P$39
L5_GND
  pour L5_GND: -2.08,86.03 99.57,85.95 99.57,9.93 -2.16,9.93
MBOSS_APRSDP_DIO
  BOTTOM 0.203: MSN_II.P$38 73.91,36 74.89,36.98 81.47,36.98 82.5,35.95 83.9,35.95 RAB.P$38
MBOSS_HNT_3.3V_DIO
  BOTTOM 0.203: MSN_I.P$39 69.6,34 70.6,33 73.85,33 74.85,34 MSN_II.P$39 79.87,34 80.85,33.02 84.96,33.02 85.94,34 RAB.P$39
MBOSS_HNT_5V_DIO
  BOTTOM 0.152: MSN_II.P$40 70.9,34 69.95,34.95 65.1,34.95 64.15,34 MSN_I.P$40
  BOTTOM 0.203: RAB.P$40 81.3,34 80.32,34.98 74.78,34.98 73.8,34 MSN_II.P$40
MBOSS_SFWARD_DIO
  BOTTOM 0.203: MSN_II.P$37 80.82,36 81.8,35.02 85.01,35.02 85.95,35.96 RAB.P$37
MBOSS_SFWARD_UART_RX
  BOTTOM 0.203: MSN_II.P$30 74.3,43 79,43 80,44 RAB.P$30
MBOSS_SFWARD_UART_TX
  BOTTOM 0.203: RAB.P$29 84.95,45 79.5,45 78.5,44 MSN_II.P$29
MPIC_CAM_UART_RX
  TOP 0.203: MSN_II.P$28 70.85,46 69.87,46.98 64.63,46.98 MSN_I.P$28 63.6,45.95 62.87,45.95 60.35,45.95 59.3,47 48,47 COM.P$28 45.5,46 44.52,46.98 41.44,46.98 40.46,46 EPS/OBC.P$28
MPIC_CAM_UART_TX
  TOP 0.203: MSN_II.P$27 74.32,45.02 70.83,45.02 69.85,46 MSN_I.P$27 64.67,45.02 60.1,45.02 59.12,46 COM.P$27 48.02,45.02 44.78,45.02 43.8,46 EPS/OBC.P$27
MPIC_MBOSS_DIO
  BOTTOM 0.203: RAB.P$42 78.9,32 77.92,32.98 74.83,32.98 73.85,32 MSN_II.P$42 70.5,32 69.5,33 64.65,33 MSN_I.P$42 56.45,32 55.47,32.98 47.98,32.98 COM.P$42 44.75,32 43.75,33 40.85,33 EPS/OBC.P$42
MPIC_MBOSS_UART_RX
  TOP 0.203: COM.P$22 48,53 51.56,53 51.75,53 53.26,51.49 63.14,51.49 MSN_I.P$22
  BOTTOM 0.203: RAB.P$22 79.55,52 78.57,52.98 74.28,52.98 MSN_II.P$22 68.95,52 67.97,52.98 64.63,52.98 MSN_I.P$22 | EPS/OBC.P$22 40.85,53 44.35,53 45.25,52.1 45.25,52 COM.P$22
MPIC_MBOSS_UART_TX
  TOP 0.203: COM.P$21 51.7,52 52.7,51 64.65,51 MSN_I.P$21
  BOTTOM 0.203: RAB.P$21 84.95,51 79.3,51 78.3,52 MSN_II.P$21 74.85,52 73.87,51.02 68.63,51.02 67.65,52 MSN_I.P$21 | EPS/OBC.P$21 44,52 44.98,51.02 48.02,51.02 COM.P$21
MPIC_UART_RX_TO_ADCS
  BOTTOM 0.203: EPS/OBC.P$38 40.46,36 41.44,36.98 44.07,36.98 45.05,36 COM.P$38 47.98,36.98 56.47,36.98 57.45,36 MSN_I.P$38
MPIC_UART_TX_2_ADCS
  BOTTOM 0.203: EPS/OBC.P$37 43.75,36 44.73,35.02 48.02,35.02 COM.P$37 55.95,36 56.95,35 64.07,35 65.07,36 MSN_I.P$37
MTQ_-X_PWR  (via drill 0.35)
  TOP 1.27: v46.95,84.3 SP4/+X.7
  L2_GND 1.016: v70.13,43.54 70.13,22.07 57.56,9.5 51.63,9.5 49.05,6.91 SP3/-X.7
  L3 1.016: MSN_I.P$29 69.67,44 v70.13,43.54
  L3 1.27: MSN_I.P$29 67.65,44 70.75,47.1 70.75,78.15 64.6,84.3 v46.95,84.3
MTQ_-X_RTN  (via drill 0.35)
  L3 1.016: 61.85,43.95 61.85,29.34 60.86,28.35 v60.83,28.37
  L3 1.27: v48.95,81.85 50,80.8 55,80.8 58.85,76.95 58.85,46.95 61.85,43.95 63.6,43.95 MSN_I.P$30
  BOTTOM 1.016: v60.83,28.37 47.05,14.59 SP3/-X.6
  BOTTOM 1.27: v48.95,81.85 SP4/+X.6
MTQ_-Z_PWR
  L3 1.016: SP5/-Z.7 23.05,84.06 30.21,76.9 53,76.9 56.05,73.85 56.05,29.5 59.55,26 MSN_I.P$48
MTQ_-Z_RTN
  L3 0.813: 69.15,24.65 67.8,26 MSN_I.P$47
  L3 1.016: 69.15,24.65 69.15,22.85 67.85,21.3 65.92,21.3 65.91,21.31 64.99,21.31 64.98,21.3 59.95,21.3 52.69,28.56 52.69,52.61 52.7,52.62 52.7,73.45 51.55,74.6 27.94,74.6 21.03,81.51 21.05,81.53 SP5/-Z.6
N$2
  TOP 0.203: 22.27,23.44 19.46,26.25 SJ_TEMP.1
  TOP 0.254: C2.1 25.67,20.52 R2.1 22.27,23.44
N$4
  TOP 0.254: U$3.3 18.87,20.52 R2.2
OBC_COM1
  TOP 0.203: EPS/OBC.P$7 44.2,66 45.2,65 47.65,65 48.65,66 COM.P$7
OBC_COM2
  TOP 0.203: COM.P$8 45.4,66 44.4,67 40.85,67 EPS/OBC.P$8
OBC_COM3
  TOP 0.203: COM.P$43 48,29 44.65,29 43.65,30 EPS/OBC.P$43
OBC_COM4
  TOP 0.203: EPS/OBC.P$44 40.85,31 43.95,31 44.95,30 COM.P$44
OBC_COM5
  TOP 0.203: COM.P$45 48,27 44.15,27 43.15,28 EPS/OBC.P$45
OBC_COM6
  TOP 0.203: COM.P$46 44.45,28 43.45,29 40.85,29 EPS/OBC.P$46
OBC_COM7
  TOP 0.203: EPS/OBC.P$47 42.8,26 43.8,25 48.15,25 49,25.85 COM.P$47
OBC_COM8
  TOP 0.203: COM.P$48 46.9,25.9 44.2,25.9 43.1,27 40.85,27 EPS/OBC.P$48
PHOTODIODE
  L3 0.203: RAB.P$32 84.95,43 84.95,44.6 85.35,45 86.65,45 87.1,45.45 87.1,47.01 SP2/-Y.7
POWERSC_+X_NEW
  L2_GND 0.254: FAB.P$27 13.4,46 12.4,47 10.4,47 8.9,45.5 8.9,45 12.55,45 FAB.P$27
  L2_GND 0.61: SP1/+Y.8 8.85,44.95 8.9,45
  L2_GND 1.016: SP1/+Y.9 SP1/+Y.8
  L5_GND 0.203: 12.1,44.95 13.15,46 FAB.P$27
  L5_GND 0.254: FAB.P$27 13.4,46 12.5,46.9 11.93,46.9 11.93,46.91 10.31,46.91 9.55,46.15 9.55,44.95 12.1,44.95
  L5_GND 0.61: SP1/+Y.8 9.55,44.95
  L5_GND 1.016: SP1/+Y.9 SP1/+Y.8
  BOTTOM 0.203: SP1/+Y.8 7.4,44.95 9.45,47 12.55,47 FAB.P$27 12.55,45 8.35,45
  BOTTOM 1.016: SP1/+Y.8 6.61,45 8.35,45
  BOTTOM 1.27: SP1/+Y.8 SP1/+Y.9
POWERSC_+Y_NEW
  L5_GND 0.254: FAB.P$37 12.55,37 10.4,37 9.5,36.1 9.5,36 10.5,35 12.55,35 FAB.P$37
  L5_GND 1.016: SP3/-X.9 SP3/-X.8 51.05,8.15 50.25,8.95 16.96,8.95 8.2,17.71 8.2,34.7 9.5,36
  BOTTOM 1.27: SP3/-X.8 SP3/-X.9
POWERSC_-Y_NEW
  L5_GND 0.254: FAB.P$21 12.55,53 10.6,53 9.6,52 10.6,51 12.55,51 FAB.P$21
  L5_GND 1.016: SP4/+X.8 SP4/+X.9 42.95,85.65 40.85,83.55 21.45,83.55 14.55,76.65 11.95,76.65 9.1,73.8 9.1,52.5 9.6,52
  BOTTOM 1.27: SP4/+X.9 SP4/+X.8
POWERSC_-Z_NEW
  L2_GND 1.016: FAB.P$33 16.85,40 18.65,41.8 18.65,75.4 25.05,81.8 SP5/-Z.8 SP5/-Z.9
  BOTTOM 1.27: SP5/-Z.8 SP5/-Z.9
PROG1  (via drill 0.35)
  TOP 0.203: FAB.P$1 v13.55,82.15
  BOTTOM 0.203: EPS/OBC.P$1 41.85,75.24
  BOTTOM 0.254: 41.85,75.24 33.34,83.75 15.15,83.75 v13.55,82.15
PROG2
  BOTTOM 0.203: EPS/OBC.P$2 39.85,75.5
  BOTTOM 0.254: 39.85,75.5 34.35,81 28.25,81 26.15,83.1 20.39,83.1 11.55,74.26 FAB.P$2
PROG3
  TOP 0.203: EPS/OBC.P$3 40.87,70.98 39.38,70.98 38.4,70 FAB.P$3
PROG4
  TOP 0.203: FAB.P$4 12.55,69 38.34,69 39.34,70 EPS/OBC.P$4
PROG5
  TOP 0.203: EPS/OBC.P$5 40.85,69 39.22,69 38.22,68 FAB.P$5
PROG6
  TOP 0.203: FAB.P$6 12.55,67 38.85,67 EPS/OBC.P$6
PSC_1+
  L3 0.203: RAB.P$34 84.95,41 86.5,41 87.45,41.95 87.45,43.36 SP2/-Y.5
  BOTTOM 0.203: RAB.P$34 84.95,41 86.5,41 87.45,41.95 87.45,43.36 SP2/-Y.5
PSC_1-
  L3 0.203: RAB.P$33 86.5,40 88.05,41.55 88.05,42.4 88.7,43.05 SP2/-Y.4
  BOTTOM 0.254: RAB.P$33 86.5,40 88.05,41.55 88.05,42.4 88.7,43.05 SP2/-Y.4
PSC_2+
  BOTTOM 0.203: RAB.P$11 87.25,60.7 87.25,52.58 88.78,51.05 SP2/-Y.8
PSC_2-
  L3 0.203: RAB.P$31 86.95,43 86.95,44.6 89.14,46.79 SP2/-Y.6
  BOTTOM 0.203: RAB.P$31 86.95,43 86.95,44.61 89.14,46.8 SP2/-Y.6
RAW_POWER
  L2_GND 1.016: FAB.P$30 FAB.P$29 | EPS/OBC.P$30 EPS/OBC.P$29
  L3 1.27: EPS/OBC.P$30 EPS/OBC.P$29 | FAB.P$30 FAB.P$29
  L4_PWR 1.27: EPS/OBC.P$29 EPS/OBC.P$30 | FAB.P$29 FAB.P$30
  L4_PWR 2: FAB.P$29 EPS/OBC.P$30
  L5_GND 1.016: EPS/OBC.P$29 EPS/OBC.P$30 | FAB.P$29 FAB.P$30
  L5_GND 2: FAB.P$29 EPS/OBC.P$30
  BOTTOM 0.813: FAB.P$29 16.6,44 18.8,46.2 18.77,46.23 R5.1 R7.1
  BOTTOM 1.27: EPS/OBC.P$30 EPS/OBC.P$29 | FAB.P$30 FAB.P$29
SUP5V0
  TOP 1.27: FAB.P$15 FAB.P$16 | EPS/OBC.P$16 EPS/OBC.P$15 | COM.P$15 MSN_I.P$16 MSN_I.P$15 | MSN_II.P$16 MSN_II.P$15 | RAB.P$16 RAB.P$15
  L2_GND 1.27: FAB.P$16 FAB.P$15 | EPS/OBC.P$16 EPS/OBC.P$15 COM.P$16 COM.P$15 | MSN_I.P$16 MSN_I.P$15 | MSN_II.P$16 MSN_II.P$15 | RAB.P$16 RAB.P$15
  L3 1.27: FAB.P$16 FAB.P$15 EPS/OBC.P$16 | COM.P$15 COM.P$16 | MSN_I.P$16 MSN_I.P$15 | MSN_II.P$16 MSN_II.P$15 | RAB.P$16 RAB.P$15
  L4_PWR 1.27: FAB.P$16 FAB.P$15 EPS/OBC.P$16 | COM.P$16 COM.P$15 MSN_I.P$16 | RAB.P$15 RAB.P$16 MSN_II.P$15
  L5_GND 1.016: EPS/OBC.P$16 FAB.P$15 FAB.P$16 | MSN_I.P$16 COM.P$15 COM.P$16 | RAB.P$15 RAB.P$16
  BOTTOM 1.27: FAB.P$16 FAB.P$15 | EPS/OBC.P$16 EPS/OBC.P$15 COM.P$16 COM.P$15 | MSN_I.P$16 MSN_I.P$15 MSN_II.P$16 | RAB.P$16 RAB.P$15
SUP_3V3_1  (via drill 0.35)
  TOP 0.254: U$3.4 16.79,20.49 | 16.79,20.49 14.58,20.49 C1.1 | FAB.P$49 13.55,23.73 16.79,20.49
  TOP 1.27: EPS/OBC.P$50 EPS/OBC.P$49 COM.P$50 COM.P$49 | MSN_I.P$50 MSN_I.P$49 MSN_II.P$50 MSN_II.P$49 | FAB.P$50 FAB.P$49
  L2_GND 1.27: COM.P$50 COM.P$49 54.75,24 58.9,28.15 58.9,70.95 50.55,79.3 46.7,79.3 v42.75,83.25 | EPS/OBC.P$49 EPS/OBC.P$50 | MSN_I.P$50 MSN_I.P$49 | RAB.P$50 RAB.P$49
  L3 1.27: RAB.P$49 RAB.P$50 MSN_II.P$49 MSN_II.P$50 | EPS/OBC.P$50 EPS/OBC.P$49 COM.P$50 COM.P$49 | FAB.P$50 FAB.P$49
  L4_PWR 1.27: RAB.P$49 RAB.P$50 | MSN_II.P$50 MSN_I.P$49 MSN_I.P$50 | FAB.P$50 FAB.P$49 EPS/OBC.P$50 | EPS/OBC.P$49 COM.P$50
  L5_GND 0.508: 56.95,90.95 57.5,91 18.41,91 SP5/-Z.2 13.05,84.52 8,79.48 8,58.09 SP1/+Y.2 | v42.75,83.25 45.3,85.8 55.7,85.8 56.95,87.05 SP4/+X.2 | SP3/-X.2 39.05,5.95 40,5 77.8,5 84,11.2
  L5_GND 0.61: RAB.P$49 87.6,24 87.95,24.35 87.95,38.2 88.8,39.05 SP2/-Y.2 90.3,39.05 90.78,39.52 90.78,76.03 75.85,90.95 56.95,90.95 SP4/+X.2
  L5_GND 0.813: RAB.P$50 84,23.95 84,11.2
  L5_GND 1.016: EPS/OBC.P$49 COM.P$50 COM.P$49 | MSN_II.P$50 MSN_I.P$49 MSN_I.P$50 | FAB.P$50 FAB.P$49 | RAB.P$50 RAB.P$49
  BOTTOM 1.016: MSN_II.P$49 RAB.P$50
  BOTTOM 1.27: FAB.P$50 FAB.P$49 | COM.P$49 COM.P$50 EPS/OBC.P$49 | MSN_I.P$50 MSN_I.P$49 | RAB.P$50 RAB.P$49
SUP_3V3_2
  TOP 1.27: COM.P$26 COM.P$25 | MSN_I.P$26 MSN_I.P$25 MSN_II.P$26 MSN_II.P$25 | RAB.P$26 RAB.P$25 | EPS/OBC.P$26 EPS/OBC.P$25
  L2_GND 1.016: FAB.P$25 FAB.P$26
  L3 1.27: FAB.P$26 FAB.P$25 | COM.P$26 COM.P$25 | MSN_I.P$26 MSN_I.P$25 | MSN_II.P$26 MSN_II.P$25
  L4_PWR 1.27: FAB.P$26 FAB.P$25 EPS/OBC.P$26 | MSN_II.P$26 MSN_I.P$25 | COM.P$26 COM.P$25 MSN_I.P$26 | RAB.P$26 RAB.P$25
  L5_GND 1.016: MSN_II.P$25 RAB.P$26 RAB.P$25 | FAB.P$26 FAB.P$25 | MSN_I.P$25 MSN_I.P$26 | EPS/OBC.P$25 COM.P$26
  BOTTOM 1.27: FAB.P$26 FAB.P$25 | MSN_I.P$26 MSN_I.P$25 MSN_II.P$26 | RAB.P$26 RAB.P$25 | COM.P$25 EPS/OBC.P$26
SUP_UNREG_1
  TOP 1.27: FAB.P$24 FAB.P$23 | EPS/OBC.P$24 EPS/OBC.P$23 | COM.P$24 COM.P$23 | MSN_I.P$24 MSN_I.P$23 MSN_II.P$24 MSN_II.P$23 | RAB.P$24 RAB.P$23
  L2_GND 1.27: FAB.P$24 FAB.P$23
  L3 1.27: FAB.P$24 FAB.P$23 | EPS/OBC.P$24 EPS/OBC.P$23 | MSN_II.P$23 MSN_II.P$24 | MSN_I.P$23 MSN_I.P$24 | COM.P$24 COM.P$23
  L4_PWR 1.27: FAB.P$24 FAB.P$23 EPS/OBC.P$24 | COM.P$24 COM.P$23 MSN_I.P$24 | MSN_I.P$23 MSN_II.P$24 | RAB.P$23 RAB.P$24 MSN_II.P$23
  L5_GND 1.016: EPS/OBC.P$23 COM.P$24 | MSN_II.P$24 MSN_I.P$23 MSN_I.P$24 | FAB.P$23 FAB.P$24 | RAB.P$24 RAB.P$23
  BOTTOM 1.27: FAB.P$24 FAB.P$23 | EPS/OBC.P$24 EPS/OBC.P$23 COM.P$24 COM.P$23 | MSN_I.P$24 MSN_I.P$23 MSN_II.P$24 | RAB.P$24 RAB.P$23
SUP_UNREG_2
  TOP 1.27: MSN_II.P$35 RAB.P$36 RAB.P$35 | MSN_I.P$35 MSN_I.P$36 | COM.P$35 COM.P$36 | EPS/OBC.P$35 EPS/OBC.P$36
  L2_GND 1.016: FAB.P$36 FAB.P$35
  L3 1.27: RAB.P$35 RAB.P$36 | MSN_I.P$36 MSN_I.P$35 MSN_II.P$36 MSN_II.P$35 | COM.P$36 COM.P$35 | EPS/OBC.P$35 EPS/OBC.P$36 | FAB.P$36 FAB.P$35
  L4_PWR 1.016: SP2/-Y.3 86.09,38 RAB.P$35
  L4_PWR 1.27: MSN_I.P$35 MSN_I.P$36 COM.P$35 | FAB.P$36 FAB.P$35 EPS/OBC.P$36 | EPS/OBC.P$35 COM.P$36
  L5_GND 1.016: COM.P$36 COM.P$35 | MSN_I.P$36 MSN_I.P$35 MSN_II.P$36 | RAB.P$35 RAB.P$36
  L5_GND 1.27: FAB.P$36 FAB.P$35 | EPS/OBC.P$36 EPS/OBC.P$35
  BOTTOM 1.016: MSN_I.P$36 MSN_I.P$35 | COM.P$35 COM.P$36 | EPS/OBC.P$35 EPS/OBC.P$36 | FAB.P$36 FAB.P$35 | RAB.P$35 86.04,38 89.09,41.05 SP2/-Y.3
  BOTTOM 1.27: COM.P$36 EPS/OBC.P$35
TEMP1_+X_NEW
  L3 0.254: SP1/+Y.10 7.65,40.95 9.5,42.8 9.5,44.9 10.6,46 FAB.P$28
TEMP2_-Y_NEW
  L3 0.254: FAB.P$22 10.5,52 9.4,53.1 9.4,87.3 10.05,87.95 40.55,87.95 40.95,88.35 SP4/+X.10
TEMP3_-Z_NEW  (via drill 0.35)
  L3 0.254: FAB.P$34 10.2,40 9.2,39 9.2,36.4 7.95,35.15 6.55,35.15 4.85,36.85 4.85,74.9 v6.55,76.6 | SP5/-Z.10 29.05,86.52 28.32,87.25 10.59,87.25 9.91,86.56 9.91,80.69 v10.6,80
  L4_PWR 0.254: v6.55,76.6 8.35,76.6 10.6,78.85 v10.6,80
TEMP4_+Y_NEW
  L3 0.254: SP3/-X.10 52.06,9.85 14.55,9.85 7.7,16.7 7.7,33.5 10.2,36 FAB.P$38
TEMP5_-X_NEW
  L3 0.254: SP2/-Y.10 89.2,55.05 90.8,53.45 90.8,20.05 88.3,17.55 37.85,17.55 14.4,41 12.55,41 FAB.P$32

### Text on the board
tPlace: BPB FM / IZB & MAP | Japan / Philippines / Paraguay | SW3 | SW2 | SW1 | SW4
bPlace: BPB FM / IZB & MAP | Japan / Philippines / Paraguay
tNames: 1 | 1 | 5 | 5 | 5 | 5 | 1 | GND | GND | GND | 15 | 5V0 | 15 | 5V0 | 15 | 15 | UNREG1 | UNREG1 | 25 | 3V3 2 | 25 | 3V3 2 | 25 | 25 | RAW POWER | 35 | UNREG2 | 35 | UNREG2 | 35 | 35 | 1 | 45 | 45 | 45 | 45 | 3V3 1 | 3V3 1 | +Y | 1 | -X | LaSEINE, Kyutech
bNames: -Y | -X | Doraemon | LaSEINE, Kyutech